# EAGLE schematic mbmc (EAGLE 7.5.0)
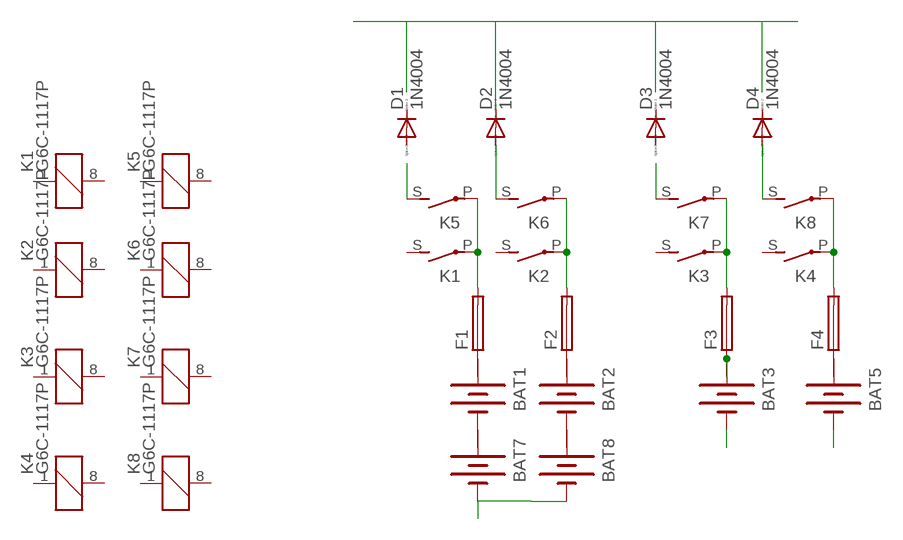
[diagram p0: schematic, sheet 1]

## Parts
BAT1  BATTERY  [BATTERY]
BAT2  BATTERY  [BATTERY]
BAT3  BATTERY  [BATTERY]
BAT5  BATTERY  [BATTERY]
BAT7  BATTERY  [BATTERY]
BAT8  BATTERY  [BATTERY]
D1  1N4004  [DO41-10]
D2  1N4004  [DO41-10]
D3  1N4004  [DO41-10]
D4  1N4004  [DO41-10]
F1  GSH15  [GSH15]
F2  GSH15  [GSH15]
F3  GSH15  [GSH15]
F4  GSH15  [GSH15]
K1  G6C-1117P  [G6C-1117P]
K2  G6C-1117P  [G6C-1117P]
K3  G6C-1117P  [G6C-1117P]
K4  G6C-1117P  [G6C-1117P]
K5  G6C-1117P  [G6C-1117P]
K6  G6C-1117P  [G6C-1117P]
K7  G6C-1117P  [G6C-1117P]
K8  G6C-1117P  [G6C-1117P]

## Nets
N$1: BAT1.+ F1.1
N$2: BAT5.-
N$3: BAT3.+ BAT3.+@1(+) F3.1
N$4: BAT3.-
N$5: BAT2.+ F2.1
N$6: BAT1.- BAT7.+
N$7: BAT2.- BAT8.+
N$8: BAT5.+ F4.1
N$9: BAT7.- BAT8.-
N$10: F1.2 K1.P(2:P) K5.P(2:P)
N$11: F2.2 K2.P(2:P) K6.P(2:P)
N$12: F3.2 K3.P(2:P) K7.P(2:P)
N$13: F4.2 K4.P(2:P) K8.P(2:P)
N$14: D2.A K6.S(2:S)
N$15: K5.S(2:S)
N$16: K7.S(2:S)
N$17: D4.A K8.S(2:S)
N$18: D2.C
Unconnected: D1.A D1.C D3.A D3.C D4.C K1.1 K1.8 K1.S(2:S) K2.1 K2.8 K2.S(2:S) K3.1 K3.8 K3.S(2:S) K4.1 K4.8 K4.S(2:S) K5.1 K5.8 K6.1 K6.8 K7.1 K7.8 K8.1 K8.8

## Power pins joined to a net without a drawn wire
+: BAT1.+@1(+) BAT2.+@1(+) BAT5.+@1(+) BAT7.+@1(+) BAT8.+@1(+)

## Library data of the parts
BAT1-BAT3 BAT5 BAT7 BAT8 = special:BATTERY: BATTERY
D1-D4 = diode:1N4004: DIODE general purpose rectifier, 1 A
F1-F4 = fuse:GSH15: FUSE HOLDER grid 15mm, 19649 Wickmann; MPN: 64900001039; OC_FARNELL: 1271673; OC_NEWARK: 02P0318
K1-K8 = relay:G6C-1117P: RELAY 1 x norm. open, 10 A/240 V, Omron; OC_FARNELL: unknown; OC_NEWARK: unknown